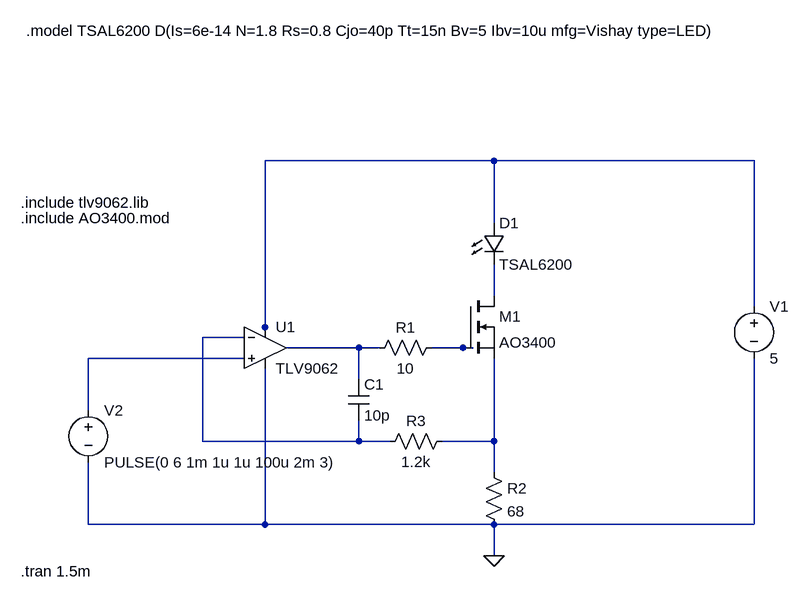
[diagram p0: schematic LED_Controller.asc]
LED_Controller.asc, the LTspice schematic file:
Version 4.1
SHEET 1 884 680
WIRE 256 -224 -96 -224
WIRE 656 -224 256 -224
WIRE 256 -128 256 -224
WIRE 256 -16 256 -64
WIRE 656 0 656 -224
WIRE -96 32 -96 -224
WIRE -128 48 -192 48
WIRE -96 48 -96 32
WIRE 48 64 -64 64
WIRE 80 64 48 64
WIRE 208 64 160 64
WIRE 224 64 208 64
WIRE -128 80 -368 80
WIRE 48 112 48 64
WIRE -368 160 -368 80
WIRE -192 208 -192 48
WIRE 48 208 48 176
WIRE 48 208 -192 208
WIRE 96 208 48 208
WIRE 256 208 256 80
WIRE 256 208 176 208
WIRE 256 256 256 208
WIRE -368 336 -368 240
WIRE -96 336 -96 96
WIRE -96 336 -368 336
WIRE 256 336 -96 336
WIRE 656 336 656 80
WIRE 656 336 256 336
WIRE 256 384 256 336
FLAG 256 384 0
SYMBOL OpAmps\\opamp2 -96 0 R0
SYMATTR InstName U1
SYMATTR Value TLV9062
SYMBOL nmos 208 -16 R0
SYMATTR InstName M1
SYMATTR Value AO3400
SYMATTR Prefix X
SYMBOL res 176 48 R90
WINDOW 0 0 56 VBottom 2
WINDOW 3 32 56 VTop 2
SYMATTR InstName R1
SYMATTR Value 10
SYMATTR SpiceLine tol=10
SYMBOL res 240 240 R0
SYMATTR InstName R2
SYMATTR Value 68
SYMATTR SpiceLine tol=10
SYMBOL res 192 192 R90
WINDOW 0 0 56 VBottom 2
WINDOW 3 32 56 VTop 2
SYMATTR InstName R3
SYMATTR Value 1.2k
SYMATTR SpiceLine tol=10
SYMBOL cap 32 112 R0
SYMATTR InstName C1
SYMATTR Value 10p
SYMBOL LED 240 -128 R0
SYMATTR InstName D1
SYMATTR Value TSAL6200
SYMBOL voltage 656 -16 R0
WINDOW 123 0 0 Left 0
WINDOW 39 0 0 Left 0
SYMATTR InstName V1
SYMATTR Value 5
SYMBOL voltage -368 144 R0
WINDOW 123 0 0 Left 0
WINDOW 39 0 0 Left 0
SYMATTR InstName V2
SYMATTR Value PULSE(0 6 1m 1u 1u 100u 2m 3)
TEXT -472 -160 Left 2 !.include tlv9062.lib
TEXT -472 -136 Left 2 !.include AO3400.mod
TEXT -464 -424 Left 2 !.model TSAL6200 D(Is=6e-14 N=1.8 Rs=0.8 Cjo=40p Tt=15n Bv=5 Ibv=10u mfg=Vishay type=LED)
TEXT -472 408 Left 2 !.tran 1.5m

The netlist it stands for:
* LED_Controller.asc
X§U1 N006 N003 N001 0 N004 TLV9062  ; pins In+ In- V+ V- OUT
X§M1 N002 N005 N007 AO3400  ; pins D G S
R1 N005 N004 10 tol=10
R2 N007 0 68 tol=10
R3 N007 N003 1.2k tol=10
C1 N004 N003 10p
D1 N001 N002 TSAL6200
V1 N001 0 5
V2 N006 0 PULSE(0 6 1m 1u 1u 100u 2m 3)
.model D D
.lib standard.dio
.include tlv9062.lib
.include AO3400.mod
.model TSAL6200 D(Is=6e-14 N=1.8 Rs=0.8 Cjo=40p Tt=15n Bv=5 Ibv=10u mfg=Vishay type=LED)
.tran 1.5m
.backanno
.end